# Altium schematic sheet Sheet2.SchDoc
size A
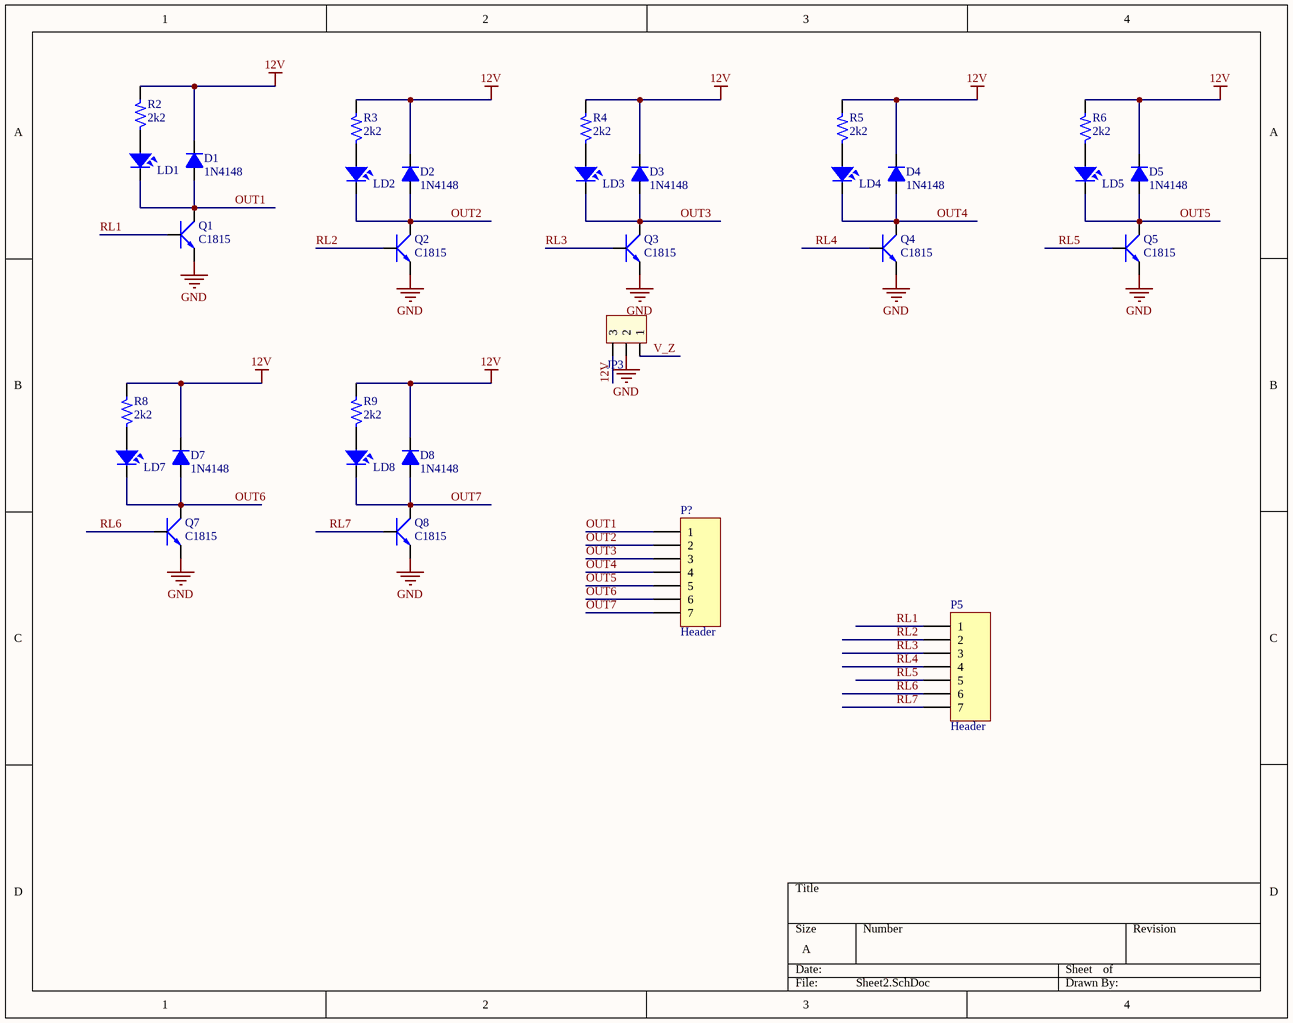
[diagram p0: Sheet2.SchDoc]

## Parts
D1  1N4148  [1n4148 smd]
D2  1N4148  [1n4148 smd]
D3  1N4148  [1n4148 smd]
D4  1N4148  [1n4148 smd]
D5  1N4148  [1n4148 smd]
D7  1N4148  [1n4148 smd]
D8  1N4148  [1n4148 smd]
JP3  Connector 3  [CON3]  (value not drawn)
LD1  LED  [LED5mm]  (value not drawn)
LD2  LED  [LED5mm]  (value not drawn)
LD3  LED  [LED5mm]  (value not drawn)
LD4  LED  [LED5mm]  (value not drawn)
LD5  LED  [LED5mm]  (value not drawn)
LD7  LED  [LED5mm]  (value not drawn)
LD8  LED  [LED5mm]  (value not drawn)
P5  Header  [con7]
P?  Header  [con7]
Q1  C1815  [SOT23B]
Q2  C1815  [SOT23B]
Q3  C1815  [SOT23B]
Q4  C1815  [SOT23B]
Q5  C1815  [SOT23B]
Q7  C1815  [SOT23B]
Q8  C1815  [SOT23B]
R2  2k2  [SM-0805]
R3  2k2  [SM-0805]
R4  2k2  [SM-0805]
R5  2k2  [SM-0805]
R6  2k2  [SM-0805]
R8  2k2  [SM-0805]
R9  2k2  [SM-0805]

## Nets
12V: D1.2(K) D2.2(K) D3.2(K) D4.2(K) D5.2(K) D7.2(K) D8.2(K) JP3.3 R2.2 R3.2 R4.2 R5.2 R6.2 R8.2 R9.2
GND: JP3.2 Q1.1(E) Q2.1(E) Q3.1(E) Q4.1(E) Q5.1(E) Q7.1(E) Q8.1(E)
OUT1: D1.1(A) LD1.2 P?.1 Q1.2(C)
OUT2: D2.1(A) LD2.2 P?.2 Q2.2(C)
OUT3: D3.1(A) LD3.2 P?.3 Q3.2(C)
OUT4: D4.1(A) LD4.2 P?.4 Q4.2(C)
OUT5: D5.1(A) LD5.2 P?.5 Q5.2(C)
OUT6: D7.1(A) LD7.2 P?.6 Q7.2(C)
OUT7: D8.1(A) LD8.2 P?.7 Q8.2(C)
RL1: P5.1 Q1.3(B)
RL2: P5.2 Q2.3(B)
RL3: P5.3 Q3.3(B)
RL4: P5.4 Q4.3(B)
RL5: P5.5 Q5.3(B)
RL6: P5.6 Q7.3(B)
RL7: P5.7 Q8.3(B)
V_Z: JP3.1
NetLD1_1: LD1.1 R2.1
NetLD2_1: LD2.1 R3.1
NetLD3_1: LD3.1 R4.1
NetLD4_1: LD4.1 R5.1
NetLD5_1: LD5.1 R6.1
NetLD7_1: LD7.1 R8.1
NetLD8_1: LD8.1 R9.1

## Library data of the parts
D1-D5 D7 D8 = D1A: Diode 1A; Value: 1N4007
JP3 = CON3: Value: Connector 3
LD1-LD5 LD7 LD8 = LED: LED Single colour Green and Red; Value: LED 3 ly Single Colour; Description: LED 5 ly Single Colour; Description: Led  Vuong
P5 P? = Header 7: Header, 7-Pin; LatestRevisionDate: 17-Jul-2002; LatestRevisionNote: Re-released for DXP Platform.; Publisher: Altium Limited
Q1-Q5 Q7 Q8 = C1815: NPN 600mW, ECB; Value: C1815
R2-R6 R8 R9 = R: Resistor 1/4W; Value: R1/4W - 1K